# EAGLE schematic Constant Input Power Supply (EAGLE 9.6.2)
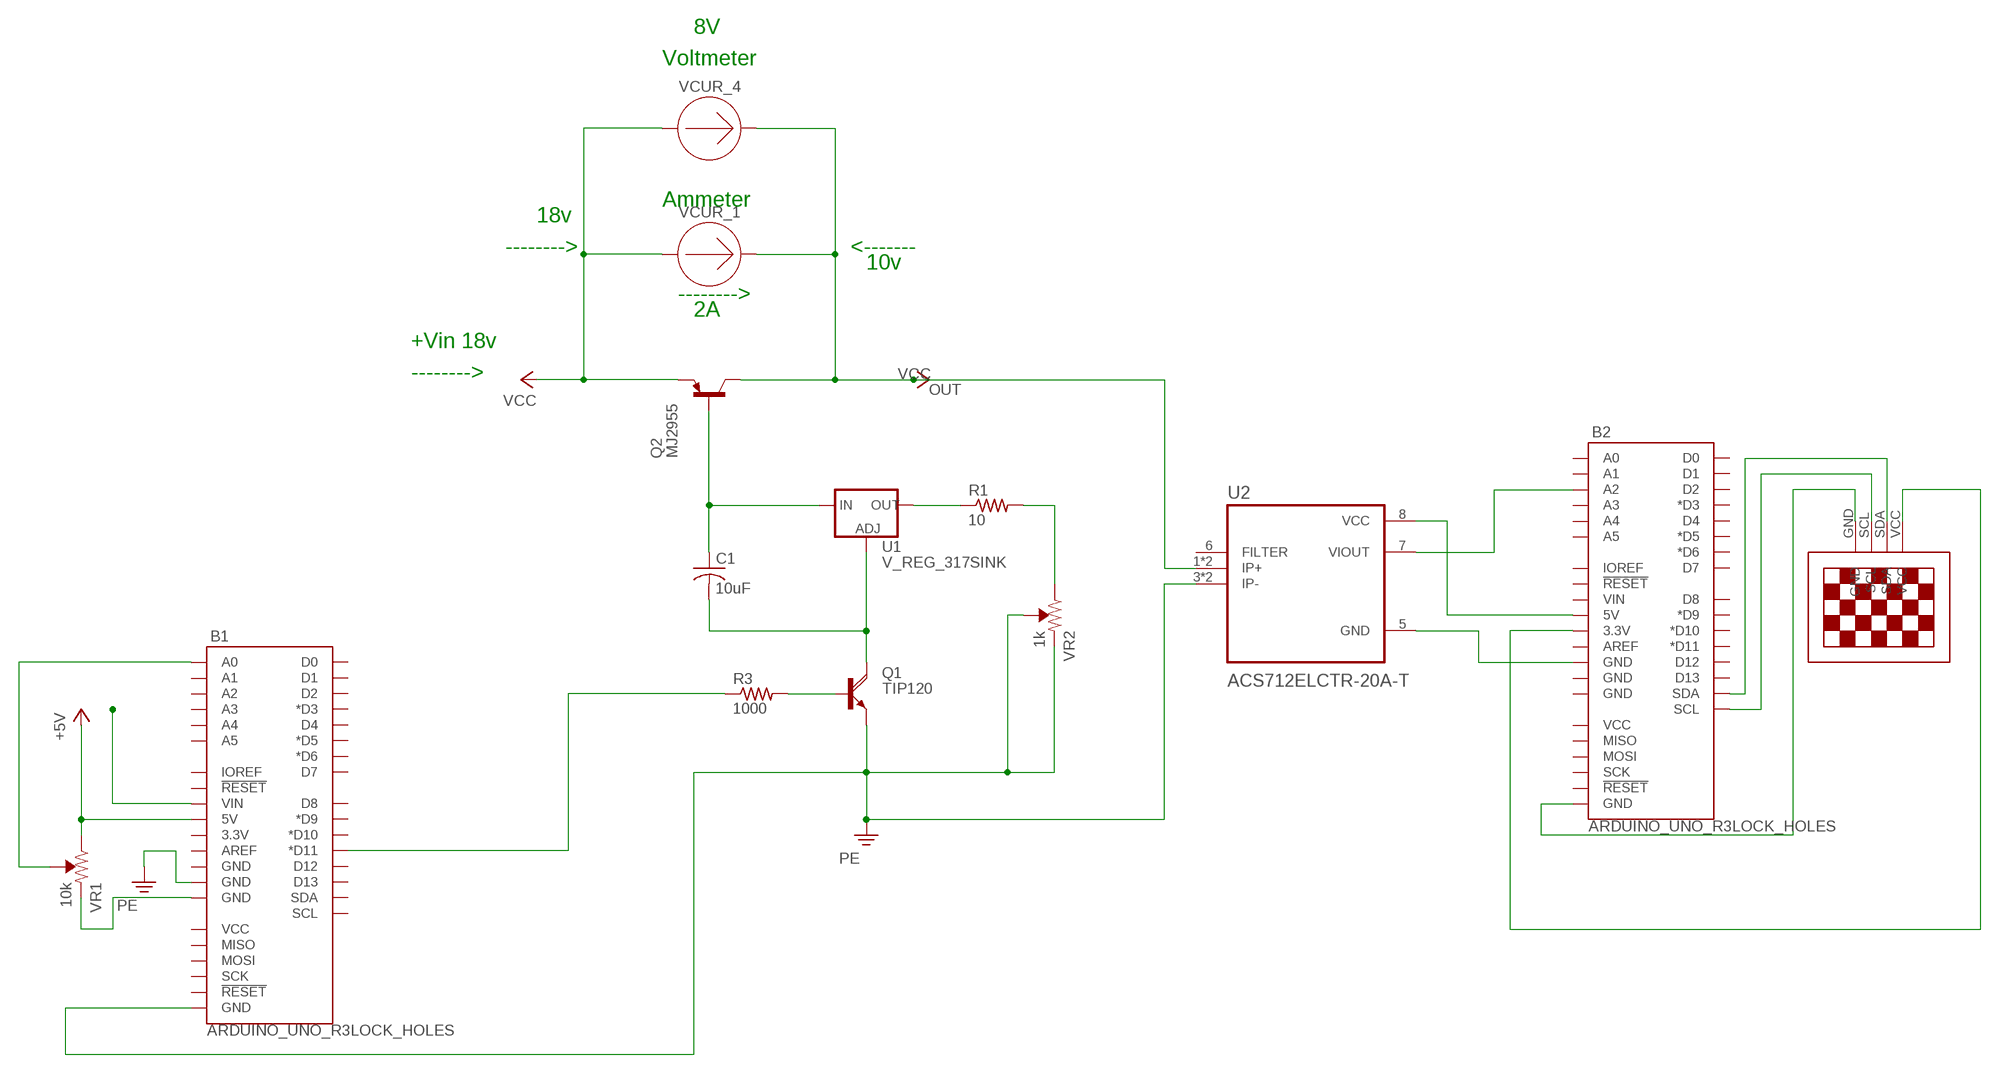
[diagram p0: schematic, sheet 1]

## Parts
B1  ARDUINO_UNO_R3LOCK_HOLES  [ARDUINO_R3_LOCK_HOLES]
B2  ARDUINO_UNO_R3LOCK_HOLES  [ARDUINO_R3_LOCK_HOLES]
C1  10uF  C-US025-024X044  [C025-024X044]
Q1  TIP120  [TO220AH]
Q2  MJ2955  [TO3]
R1  10  R-US_0204/7  [0204/7]
R3  1000  R-US_0204/7  [0204/7]
U1  V_REG_317SINK  [TO220-ADJ]
U2  ACS712ELCTR-20A-T  [SOIC127P600X175-8N]
U$1  13"OLED13"OLED  [1.3"OLED]
VCUR_1  AMMETER  (no package)
VCUR_4  AMMETER  (no package)
VR1  10k  TRIMPOT-PTH-10MM-KNOB-1/2W-10%  [TRIMPOT-PTH-3386U]
VR2  1k  TRIMPOT-PTH-10MM-KNOB-1/2W-10%  [TRIMPOT-PTH-3386U]

## Nets
+5V: B1.5V VR1.3(CW)
N$1: Q1.B R3.2
N$2: C1.2 Q1.C U1.ADJ
N$3: R1.1 U1.OUT
N$4: C1.1 Q2.B U1.IN
N$5: B1.VIN
N$6: R1.2 VR2.3(CW)
N$7: B1.D11(*D11) R3.1
N$8: B1.A0 VR1.2(WIPER)
N$9: B1.GND@2(GND) VR1.1(CCW)
N$17: B2.GND@4(GND) U2.5(GND)
N$18: B2.A2 U2.7(VIOUT)
N$19: B2.5V U2.8(VCC)
N$20: B2.GND@1(GND) U$1.GND
N$21: B2.SCL U$1.SCL
N$22: B2.SDA U$1.SDA
N$23: B2.3.3V U$1.VCC
OUT: Q2.C Q2.C/(C) U2.1(IP+) U2.2(IP+) VCUR_1.- VCUR_4.- ; supply symbol labelled VCC
PE: B1.GND@1(GND) B1.GND@3(GND) Q1.E U2.3(IP-) U2.4(IP-) VR2.1(CCW) VR2.2(WIPER)
VCC: Q2.E VCUR_1.+ VCUR_4.+
Unconnected: B1.3.3V B1.A1 B1.A2 B1.A3 B1.A4 B1.A5 B1.AREF B1.D0 B1.D1 B1.D2 B1.D3(*D3) B1.D4 B1.D5(*D5) B1.D6(*D6) B1.D7 B1.D8 B1.D9(*D9) B1.D10(*D10) B1.D12 B1.D13 B1.GND@4(GND) B1.IOREF B1.MISO B1.MOSI B1.RESET@1(!RESET!) B1.RESET@2(!RESET!) B1.SCK B1.SCL B1.SDA B1.VCC B2.A0 B2.A1 B2.A3 B2.A4 B2.A5 B2.AREF B2.D0 B2.D1 B2.D2 B2.D3(*D3) B2.D4 B2.D5(*D5) B2.D6(*D6) B2.D7 B2.D8 B2.D9(*D9) B2.D10(*D10) B2.D11(*D11) B2.D12 B2.D13 B2.GND@2(GND) B2.GND@3(GND) B2.IOREF B2.MISO B2.MOSI B2.RESET@1(!RESET!) B2.RESET@2(!RESET!) B2.SCK B2.VCC B2.VIN U2.6(FILTER)

## Notes on the sheet
- 8V
- Voltmeter
- Ammeter
- 18v
- --------> | <-------
- 10v
- -------->
- 2A
- +Vin 18v
- -------->

## Library data of the parts
B1 B2 = SparkFun-Boards:ARDUINO_UNO_R3: Arduino R3 Footprint with SPI header Arduino Uno R3 Compatible Footprint. Matches PCB size of the original board. SparkFun Products: SAMD21 Dev Breakout <https://www.sparkfun.com/products/13672> RedBoard <https://www.sparkfun.com/products/12757> R3 Stackable Headers <https://www.sparkfun.com/products/11417>
C1 = rcl:C-US: CAPACITOR, American symbol; SPICEPREFIX: C
Q1 = TIP120:TIP120: NPN DARLINGTON TRANSISTOR; DESCRIPTION: Bipolar (BJT) Transistor NPN - Darlington 60 V 5 A - 2 W Through Hole TO-220; DIGI-KEY_PART_NUMBER: 497-2539-5-ND; MF: STMicroelectronics; MP: TIP120; PACKAGE: TO-220-3 ON Semiconductor; PURCHASE-URL: https://pricing.snapeda.com/search/part/TIP120/?ref=eda
Q2 = transistor-pnp:MJ2955: PNP Transistor
R1 R3 = rcl:R-US_: RESISTOR, American symbol; SPICEPREFIX: R
U1 = SparkFun-IC-Power:V_REG_317: Voltage Regulator Standard LM317 adjustable voltage regulator. AOI (Adjust Output Input). Google 'LM317 Calculator' for easy to use app to get the two resistor values needed. 240/720 for 5V output. 240/390 for 3.3V output. Spark Fun Electronics SKU : COM-00527
U2 = ACS712ELCTR-20A-T:ACS712ELCTR-20A-T: Check availability <https://pricing.snapeda.com/parts/ACS712ELCTR-20A-T/Allegro/view-part?ref=eda>; AVAILABILITY: In Stock; DESCRIPTION: Current Sensor 20A 1 Channel Hall Effect, Open Loop Bidirectional 8-SOIC (0.154, 3.90mm Width); MF: Allegro; MP: ACS712ELCTR-20A-T; PACKAGE: SOIC-8 Allegro MicroSystems LLC; PRICE: None; PURCHASE-URL: https://pricing.snapeda.com/search/part/ACS712ELCTR-20A-T/?ref=eda
U$1 = 13oled:13"OLED
VCUR_1 VCUR_4 = ngspice-simulation:AMMETER: AMMETER
VR1 = SparkFun-Resistors:TRIMPOT: Trimming Potentiometer (Trimpot) Three-terminal potentiometers, with an adjustable wiper and two adjustable resistors. A pot can be used to create a configurable voltage divider, or as a variable resistor. "Trimpots" are a subset of potentiometers, usually intended for "set-and-forget" applications. They're often more delicate than standard potentiometers - rated for fewer turns. Variants PTH-KNOB - PTH Trimpot w/ finger-adjustable knob Trimpot 10K with Knob <https://www.sparkfun.com/products/9806> (COM-09806) Datasheet <http://www.sparkfun.com/datasheets/Components/General/TSR-3386.pdf> SMD-3MM-CLOSED-FRAME - SMD 3mm Square Closed-Frame Trimpot Used on e.g. EasyDriver - Stepper Motor Driver <https://www.sparkfun.com/products/12779> Datasheet <http://www.bitechnologies.com/pdfs/22.pdf> (22AR10KTR) SMD-5MM - SMD 5mm Square Closed-Frame Trimpot Used on e.g. IOIO-OTG - V2.2 <https://www.sparkfun.com/products/13613> Datasheet <http://www.vishay.com/docs/51008/ts53.pdf> (TS53YL502MR10) SMD-3MM-1/10W-25% - 3mm Square Open-Frame Trimpot Used on e.g. SparkFun Shapeoko <https://www.sparkfun.com/products/13899> Datasheet <http://www.bourns.com/docs/Product-Datasheets/TC33.pdf> (TC33X-2-103E); PROD_ID: RES-09730; SF_SKU: COM-09806
VR2 = SparkFun-Resistors:TRIMPOT: Trimming Potentiometer (Trimpot) Three-terminal potentiometers, with an adjustable wiper and two adjustable resistors. A pot can be used to create a configurable voltage divider, or as a variable resistor. "Trimpots" are a subset of potentiometers, usually intended for "set-and-forget" applications. They're often more delicate than standard potentiometers - rated for fewer turns. Variants PTH-KNOB - PTH Trimpot w/ finger-adjustable knob Trimpot 10K with Knob <https://www.sparkfun.com/products/9806> (COM-09806) Datasheet <http://www.sparkfun.com/datasheets/Components/General/TSR-3386.pdf> SMD-3MM-CLOSED-FRAME - SMD 3mm Square Closed-Frame Trimpot Used on e.g. EasyDriver - Stepper Motor Driver <https://www.sparkfun.com/products/12779> Datasheet <http://www.bitechnologies.com/pdfs/22.pdf> (22AR10KTR) SMD-5MM - SMD 5mm Square Closed-Frame Trimpot Used on e.g. IOIO-OTG - V2.2 <https://www.sparkfun.com/products/13613> Datasheet <http://www.vishay.com/docs/51008/ts53.pdf> (TS53YL502MR10) SMD-3MM-1/10W-25% - 3mm Square Open-Frame Trimpot Used on e.g. SparkFun Shapeoko <https://www.sparkfun.com/products/13899> Datasheet <http://www.bourns.com/docs/Product-Datasheets/TC33.pdf> (TC33X-2-103E); PROD_ID: RES-09730; SF_SKU: COM-09806; VALUE: 10k